# Altium schematic sheet Pan-tilt.SchDoc
size A3
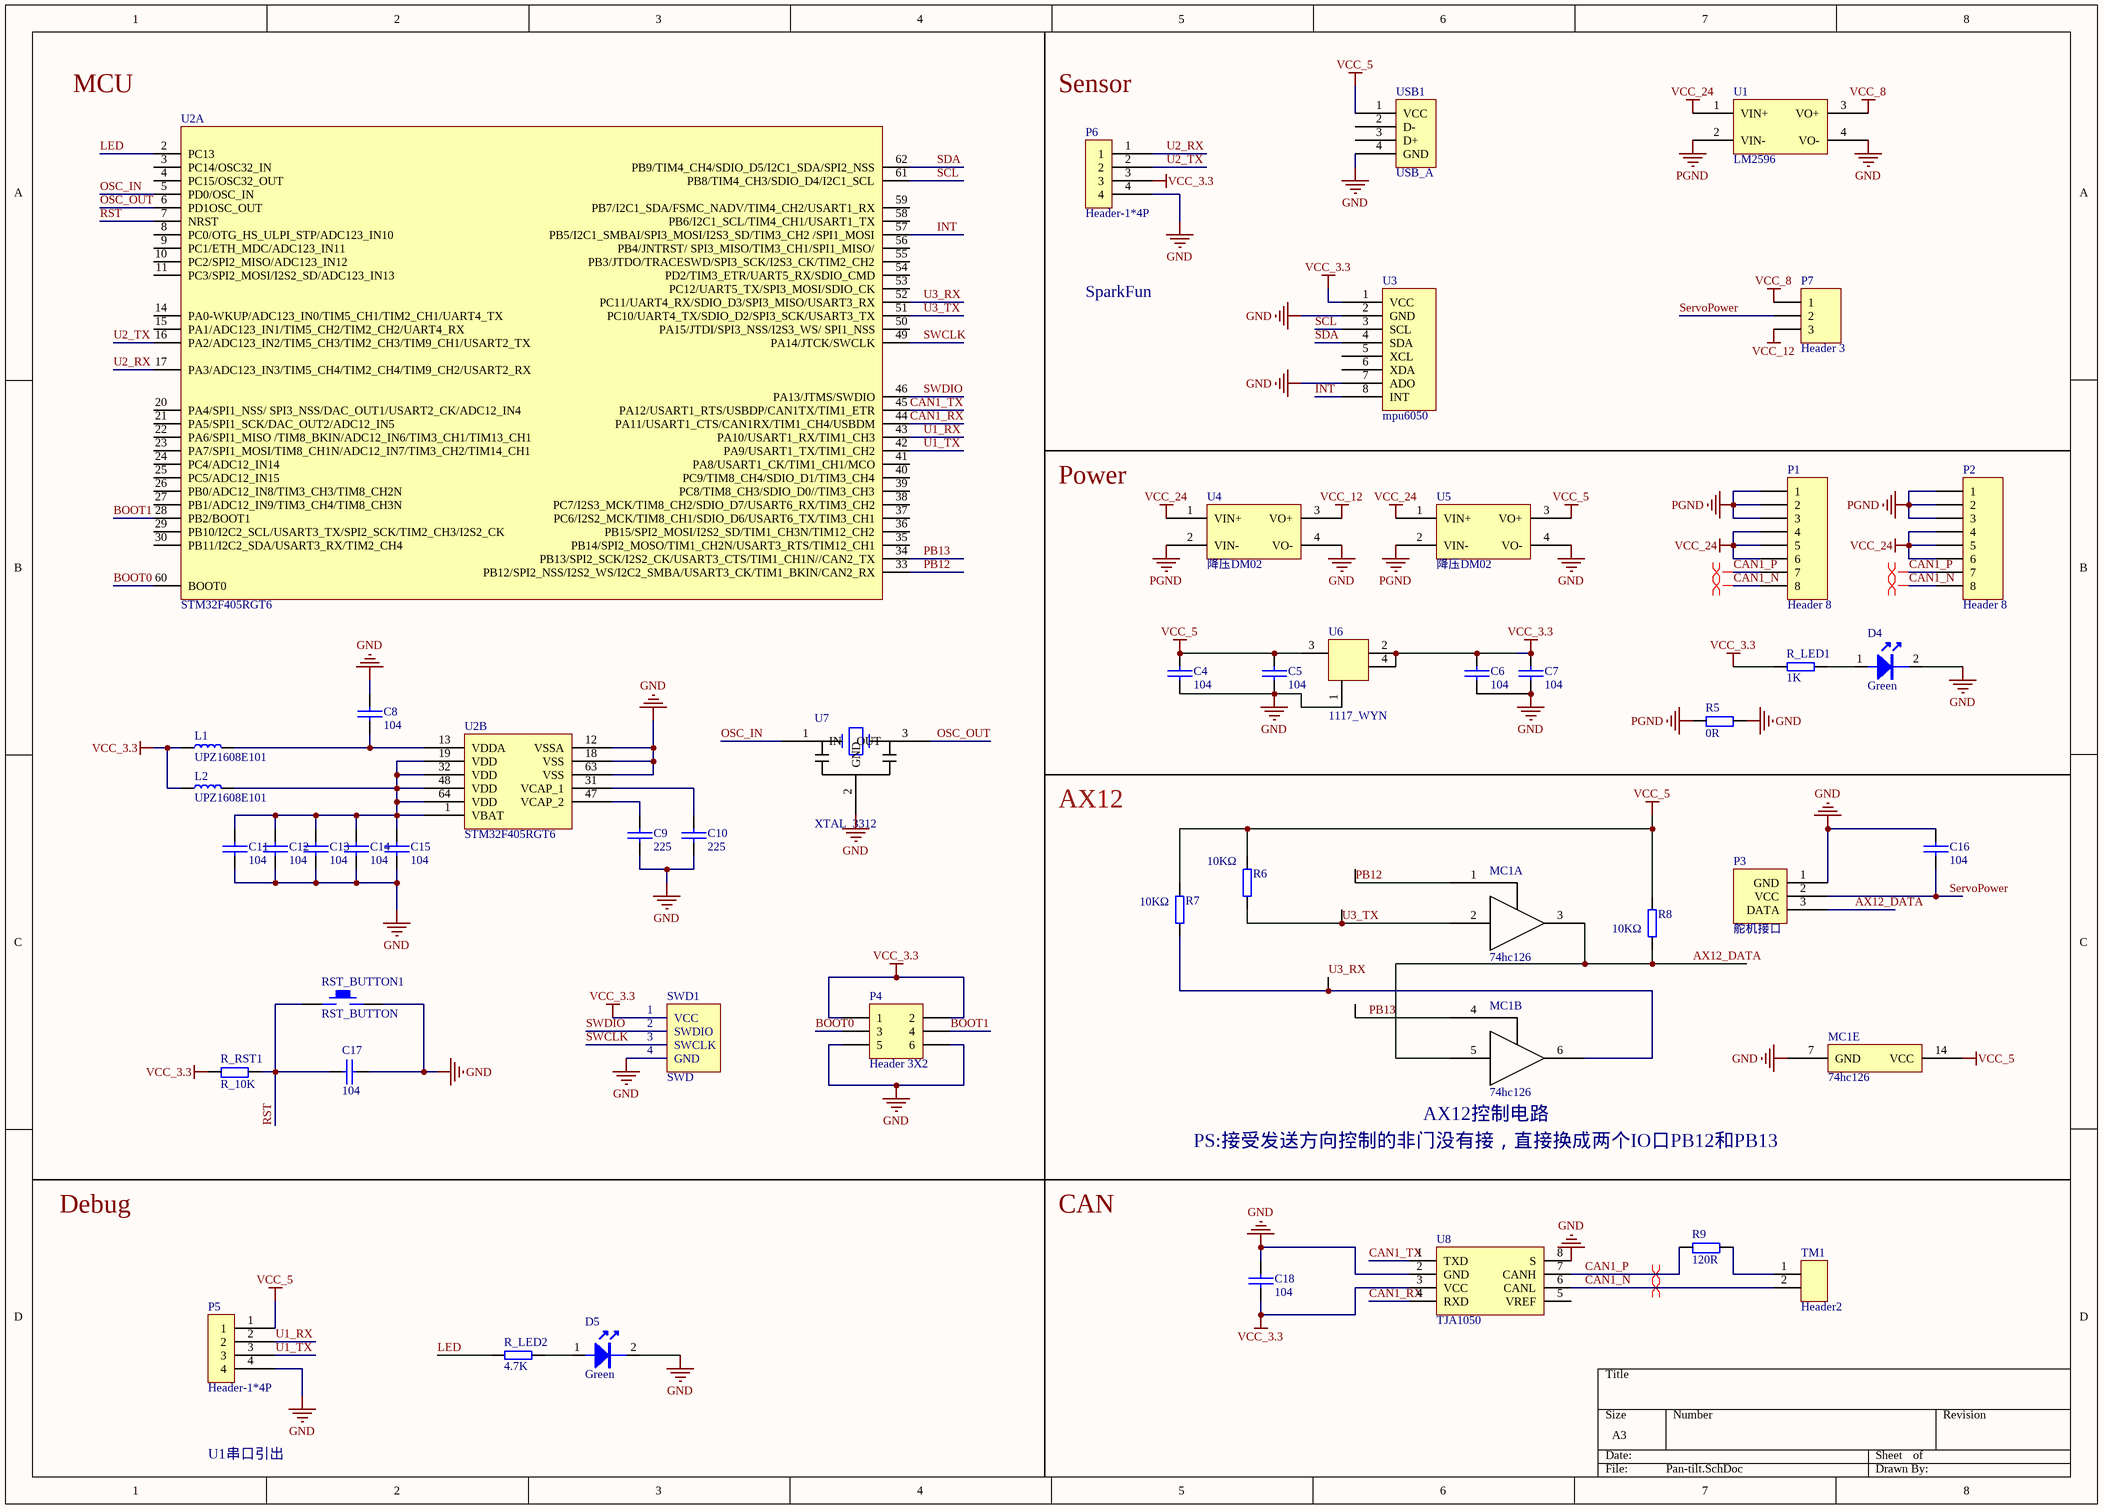
[diagram p0: Pan-tilt.SchDoc]

## Parts
C4  104  [C0603/1608]
C5  104  [C0603/1608]
C6  104  [C0603/1608]
C7  104  [C0603/1608]
C8  104  [C0603/1608]
C9  225  [C0603/1608]
C10  225  [C0603/1608]
C11  104  [C0603/1608]
C12  104  [C0603/1608]
C13  104  [C0603/1608]
C14  104  [C0603/1608]
C15  104  [C0603/1608]
C16  104  [C0603/1608]
C17  104  [C0603/1608]
C18  104  [C0603/1608]
D4  Color: Green  [LED0603-绿色]  (hidden comment: LED Green)
D5  Color: Green  [LED0603-绿色]  (hidden comment: LED Green)
L1  UPZ1608E101  [L0603/1608]
L2  UPZ1608E101  [L0603/1608]
MC1  74hc126  [SOP-14]  (parts A,B,E of 5)
P1  Header 8  [XH2.54-8P（立式）]
P2  Header 8  [XH2.54-8P（立式）]
P3  舵机接口  [5263-3P（立式）]
P4  Header 3X2  [Header-2.54-2*3P（立式）]
P5  Header-1*4P  [XH2.54-4P（立式）]
P6  Header-1*4P  [XH2.54-4P（立式）]
P7  Header 3  [Header-2.54-1*3P（立式）]
R5  0R  [R0603/1608]
R6  10KΩ  [R0603/1608]
R7  10KΩ  [R0603/1608]
R8  10KΩ  [R0603/1608]
R9  120R  [R0603/1608]
R_LED1  1K  [R0603/1608]
R_LED2  4.7K  [R0603/1608]
R_RST1  R_10K  [R0603/1608]
RST_BUTTON1  RST_BUTTON  [SW-PB]
SWD1  SWD  [XH2.54-4P（立式）]
TM1  Header2  [Header-2.54-1*2P（立式）]
U1  LM2596  [LM2596_big]
U2  STM32F405RGT6  [LQFP64]  (parts A,B of 2)
U3  mpu6050  [Header-2.54-1*8P（立式）]
U4  降压DM02  [DM02]
U5  降压DM02  [DM02]
U6  1117_WYN  [SOT-223]
U7  XTAL_3312  [XTAL-3213]
U8  TJA1050  [SOP-8]
USB1  USB_A  [USB_A Receptacle - 直插]

## Nets
GND: C4.2 C5.2 C6.2 C7.2 C8.1 C9.2 C10.2 C11.2 C12.2 C13.2 C14.2 C15.2 C16.1 C17.1 C18.1 D4.2(K) D5.2(K) MC1.7(GND) P3.1(GND) P4.5 P4.6 P5.4 P6.4 R5.2 RST_BUTTON1.2 SWD1.4(GND) U1.4(VO-) U2.12(VSSA) U2.18(VSS) U2.63(VSS) U3.2(GND) U3.7(ADO) U4.4(VO-) U5.4(VO-) U6.1 U7.2(GND) U8.2(GND) U8.8(S) USB1.4(GND)
PGND: P1.1 P1.2 P1.3 P2.1 P2.2 P2.3 R5.1 U1.2(VIN-) U4.2(VIN-) U5.2(VIN-)
VCC_3.3: C6.1 C7.1 C18.2 L1.1 L2.1 P4.1 P4.2 P6.3 R_LED1.1 R_RST1.1 SWD1.1(VCC) U3.1(VCC) U6.2 U6.4 U8.3(VCC)
VCC_5: C4.1 C5.1 MC1.14(VCC) P5.1 R6.2 R7.2 R8.2 U5.3(VO+) U6.3 USB1.1(VCC)
VCC_8: P7.1 U1.3(VO+)
VCC_12: P7.3 U4.3(VO+)
VCC_24: P1.4 P1.5 P1.6 P2.4 P2.5 P2.6 U1.1(VIN+) U4.1(VIN+) U5.1(VIN+)
AX12_DATA: MC1.3 MC1.5 P3.3(DATA) R8.1
BOOT0: P4.3 U2.60(BOOT0)
BOOT1: P4.4 U2.28(PB2/BOOT1)
CAN1_N: P1.8 P2.8 TM1.2 U8.6(CANL)
CAN1_P: P1.7 P2.7 R9.1 U8.7(CANH)
CAN1_RX: U2.44(PA11/USART1_CTS/CAN1RX/TIM1_CH4/USBDM) U8.4(RXD)
CAN1_TX: U2.45(PA12/USART1_RTS/USBDP/CAN1TX/TIM1_ETR) U8.1(TXD)
INT: U2.57(PB5/I2C1_SMBAI/SPI3_MOSI/I2S3_SD/TIM3_CH2_/SPI1_MOSI) U3.8(INT)
LED: R_LED2.1 U2.2(PC13)
OSC_IN: U2.5(PD0/OSC_IN) U7.1(IN)
OSC_OUT: U2.6(PD1OSC_OUT) U7.3(OUT)
PB12: MC1.1 U2.33(PB12/SPI2_NSS/I2S2_WS/I2C2_SMBA/USART3_CK/TIM1_BKIN/CAN2_RX)
PB13: MC1.4 U2.34(PB13/SPI2_SCK/I2S2_CK/USART3_CTS/TIM1_CH1N//CAN2_TX)
RST: C17.2 R_RST1.2 RST_BUTTON1.1 U2.7(NRST)
SCL: U2.61(PB8/TIM4_CH3/SDIO_D4/I2C1_SCL) U3.3(SCL)
SDA: U2.62(PB9/TIM4_CH4/SDIO_D5/I2C1_SDA/SPI2_NSS) U3.4(SDA)
ServoPower: C16.2 P3.2(VCC) P7.2
SWCLK: SWD1.3(SWCLK) U2.49(PA14/JTCK/SWCLK)
SWDIO: SWD1.2(SWDIO) U2.46(PA13/JTMS/SWDIO)
U1_RX: P5.2 U2.43(PA10/USART1_RX/TIM1_CH3)
U1_TX: P5.3 U2.42(PA9/USART1_TX/TIM1_CH2)
U2_RX: P6.1 U2.17(PA3/ADC123_IN3/TIM5_CH4/TIM2_CH4/TIM9_CH2/USART2_RX)
U2_TX: P6.2 U2.16(PA2/ADC123_IN2/TIM5_CH3/TIM2_CH3/TIM9_CH1/USART2_TX)
U3_RX: MC1.6 R7.1 U2.52(PC11/UART4_RX/SDIO_D3/SPI3_MISO/USART3_RX)
U3_TX: MC1.2 R6.1 U2.51(PC10/UART4_TX/SDIO_D2/SPI3_SCK/USART3_TX)
NetC8_2: C8.2 L1.2 U2.13(VDDA)
NetC9_1: C9.1 U2.47(VCAP_2)
NetC10_1: C10.1 U2.31(VCAP_1)
NetC11_1: C11.1 C12.1 C13.1 C14.1 C15.1 L2.2 U2.1(VBAT) U2.19(VDD) U2.32(VDD) U2.48(VDD) U2.64(VDD)
NetD4_1: D4.1(A) R_LED1.2
NetD5_1: D5.1(A) R_LED2.2
NetR9_2: R9.2 TM1.1

Not connected (* = marked no-connect by the designer): U2 3(PC14/OSC32_IN) 4(PC15/OSC32_OUT) 8(PC0/OTG_HS_ULPI_STP/ADC123_IN10) 9(PC1/ETH_MDC/ADC123_IN11) 10(PC2/SPI2_MISO/ADC123_IN12) 11(PC3/SPI2_MOSI/I2S2_SD/ADC123_IN13) 14(PA0-WKUP/ADC123_IN0/TIM5_CH1/TIM2_CH1/UART4_TX) 15(PA1/ADC123_IN1/TIM5_CH2/TIM2_CH2/UART4_RX) 20(PA4/SPI1_NSS/_SPI3_NSS/DAC_OUT1/USART2_CK/ADC12_IN4) 21(PA5/SPI1_SCK/DAC_OUT2/ADC12_IN5) 22(PA6/SPI1_MISO_/TIM8_BKIN/ADC12_IN6/TIM3_CH1/TIM13_CH1) 23(PA7/SPI1_MOSI/TIM8_CH1N/ADC12_IN7/TIM3_CH2/TIM14_CH1) 24(PC4/ADC12_IN14) 25(PC5/ADC12_IN15) 26(PB0/ADC12_IN8/TIM3_CH3/TIM8_CH2N) 27(PB1/ADC12_IN9/TIM3_CH4/TIM8_CH3N) 29(PB10/I2C2_SCL/USART3_TX/SPI2_SCK/TIM2_CH3/I2S2_CK) 30(PB11/I2C2_SDA/USART3_RX/TIM2_CH4) 35(PB14/SPI2_MOSO/TIM1_CH2N/USART3_RTS/TIM12_CH1) 36(PB15/SPI2_MOSI/I2S2_SD/TIM1_CH3N/TIM12_CH2) 37(PC6/I2S2_MCK/TIM8_CH1/SDIO_D6/USART6_TX/TIM3_CH1) 38(PC7/I2S3_MCK/TIM8_CH2/SDIO_D7/USART6_RX/TIM3_CH2) 39(PC8/TIM8_CH3/SDIO_D0//TIM3_CH3) 40(PC9/TIM8_CH4/SDIO_D1/TIM3_CH4) 41(PA8/USART1_CK/TIM1_CH1/MCO) 50(PA15/JTDI/SPI3_NSS/I2S3_WS/_SPI1_NSS) 53(PC12/UART5_TX/SPI3_MOSI/SDIO_CK) 54(PD2/TIM3_ETR/UART5_RX/SDIO_CMD) 55(PB3/JTDO/TRACESWD/SPI3_SCK/I2S3_CK/TIM2_CH2) 56(PB4/JNTRST/_SPI3_MISO/TIM3_CH1/SPI1_MISO/) 58(PB6/I2C1_SCL/TIM4_CH1/USART1_TX) 59(PB7/I2C1_SDA/FSMC_NADV/TIM4_CH2/USART1_RX); U3 5(XCL) 6(XDA); U8 5(VREF); USB1 2(D-) 3(D+)

## Layout directives
differential pair: CAN1_N, CAN1_P

## Notes on the sheet
- MCU
- Sensor
- SparkFun
- Power
- AX12
- (near MC1) AX12控制电路
- PS:接受发送方向控制的非门没有接，直接换成两个IO口PB12和PB13
- Debug
- CAN
- U1串口引出

## Library data of the parts
C4-C7 C16 C18 = CAP_WYN
C8-C15 C17 = Capacitor
D4 D5 = LED
L1 L2 = 磁珠: 贴片磁珠
P1 P2 = Header 8: Header, 8-Pin; LatestRevisionDate: 17-Jul-2002; LatestRevisionNote: Re-released for DXP Platform.; Publisher: Altium Limited
P4 = Header 3X2: Header, 3-Pin, Dual row; LatestRevisionDate: 17-Jul-2002; LatestRevisionNote: Re-released for DXP Platform.; Publisher: Altium Limited
P5 P6 = Header-1*4P: 单排4P排针
P7 = Header 3: Header, 3-Pin; LatestRevisionDate: 17-Jul-2002; LatestRevisionNote: Re-released for DXP Platform.; Publisher: Altium Limited
R5 R9 = Resistor
R6-R8 R_LED1 R_LED2 = RES_WYN
R_RST1 = R
U1 = 降压DM02
U2 = STM32F405RGT6: 微控制器STM32F405RGT6